# Altium schematic sheet depg0213.SchDoc
size A4
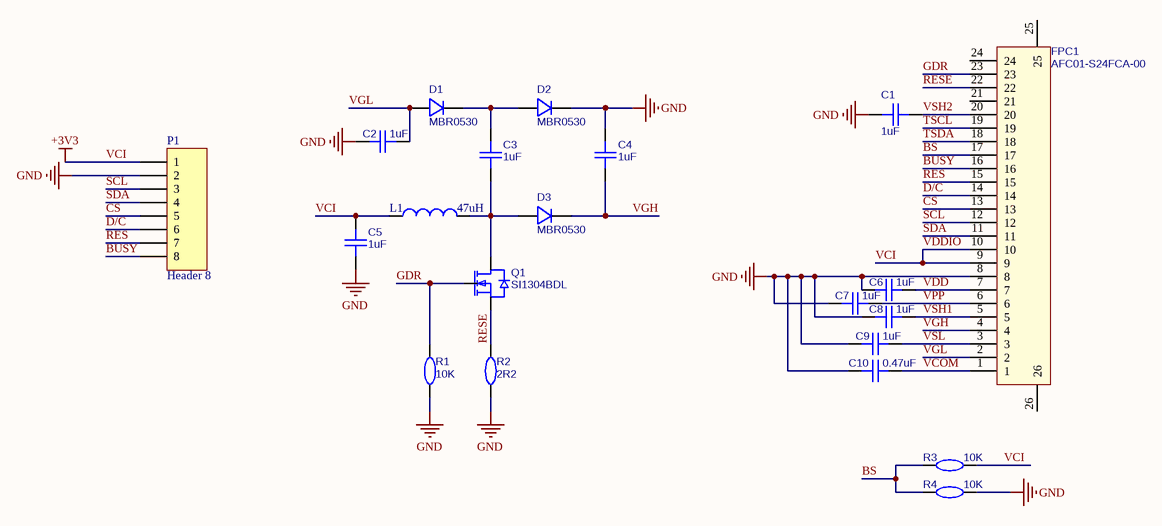
[diagram p0: depg0213.SchDoc]

## Parts
C1  1uF  [C0603]
C2  1uF  [C0603]
C3  1uF  [C0603]
C4  1uF  [C0603]
C5  1uF  [C0603]
C6  1uF  [C0603]
C7  1uF  [C0603]
C8  1uF  [C0603]
C9  1uF  [C0603]
C10  0.47uF  [C0603]
D1  MBR0530  [SOD-123_L2.8-W1.8-LS3.7-RD]
D2  MBR0530  [SOD-123_L2.8-W1.8-LS3.7-RD]
D3  MBR0530  [SOD-123_L2.8-W1.8-LS3.7-RD]
FPC1  AFC01-S24FCA-00  [FPC-SMD_P0.50-24P_FGS-XJ-H2.0]
L1  47uH  [IND-SMD_L3.0-W3.0_SMNR3015]
P1  Header 8  [HDR1X8]
Q1  SI1304BDL  [SC-70-3_L2.1-W1.3-P1.30-LS2.1-BR]
R1  10K  [R0603]
R2  2R2  [R0603]
R3  10K  [R0603]
R4  10K  [R0603]

## Nets
GND: C1.1 C2.2 C4.1 C5.2 C6.1 C7.1 C8.1 C9.1 C10.1 D2.1(C) FPC1.8 P1.2 R1.2 R2.2 R4.2
VCI: C5.1 FPC1.9 FPC1.10 L1.1 P1.1 R3.2  [also labelled +3V3, VDDIO]
BS: FPC1.17 R3.1 R4.1
BUSY: FPC1.16 P1.8
CS: FPC1.13 P1.5
D/C: FPC1.14 P1.6
GDR: FPC1.23 Q1.1(G) R1.1
RES: FPC1.15 P1.7
RESE: FPC1.22 Q1.2(S) R2.1
SCL: FPC1.12 P1.3
SDA: FPC1.11 P1.4
TSCL: FPC1.19
TSDA: FPC1.18
VCOM: C10.2 FPC1.1
VDD: C6.2 FPC1.7
VGH: C4.2 D3.1(C) FPC1.4
VGL: C2.1 D1.2(A) FPC1.2
VPP: C7.2 FPC1.6
VSH1: C8.2 FPC1.5
VSH2: C1.2 FPC1.20
VSL: C9.2 FPC1.3
NetC3_1: C3.1 D1.1(C) D2.2(A)
NetC3_2: C3.2 D3.2(A) L1.2 Q1.3(D)

Not connected (* = marked no-connect by the designer): FPC1 21 24 25 26

## Library data of the parts
C1-C10 = CAP_0603: BOM_Manufacturer: YAGEO; BOM_Manufacturer Part: CC0603GRNPO9BN200; nameAlias: Capacitance; Contributor: LCSC; BOM_Supplier: LCSC; BOM_Supplier Part: C325469; spicePre: C; spiceSymbolName: CC0603GRNPO9BN200
D1-D3 = MBR0530: C77336; BOM_Manufacturer: CJ; SMT Type: Extend; BOM_Supplier: LCSC; BOM_Manufacturer Part: MBR0530; image: //image.lceda.cn/szlcsc/C77336.jpg; BOM_Supplier Part: C77336; BOM_LCSC Assembly: Yes; spicePre: D; spiceSymbolName: MBR0530
FPC1 = AFC01-S24FCA-00: C262669; BOM_Manufacturer: JUSHUO; Contributor: LCSC; BOM_Supplier: LCSC; BOM_Supplier Part: C262669; BOM_Manufacturer Part: AFC01-S24FCA-00; spicePre: F; spiceSymbolName: AFC01-S24FCA-00
L1 = Inductor: Code_IEC: 1005; Value: 10mH; Published: 8-Jun-2000; LatestRevisionDate: 29-May-2009; LatestRevisionNote: IPC-7351 Footprint Added.; PackageReference: 0402-A; Publisher: Altium Limited; PackageDescription: Chip Inductor; Code_JEITA: 0402
P1 = Header 8: Header, 8-Pin; LatestRevisionDate: 17-Jul-2002; LatestRevisionNote: Re-released for DXP Platform.; Publisher: Altium Limited
Q1 = SI1304BDL: C710060; BOM_Manufacturer: VBsemi Elec; Contributor: LCSC; SMT Type: Extend; BOM_Supplier: LCSC; BOM_Supplier Part: C710060; BOM_Manufacturer Part: SI1304BDL; BOM_JLCPCB SMD: Yes; spicePre: Q; spiceSymbolName: SI1304BDL
R1-R4 = RES_0603: BOM_Manufacturer: LIZ; BOM_Manufacturer Part: CR0603JA0301G; nameAlias: Resistance (Ohms); BOM_Supplier: LCSC; BOM_Supplier Part: C101323; spicePre: R; spiceSymbolName: CR0603JA0301G